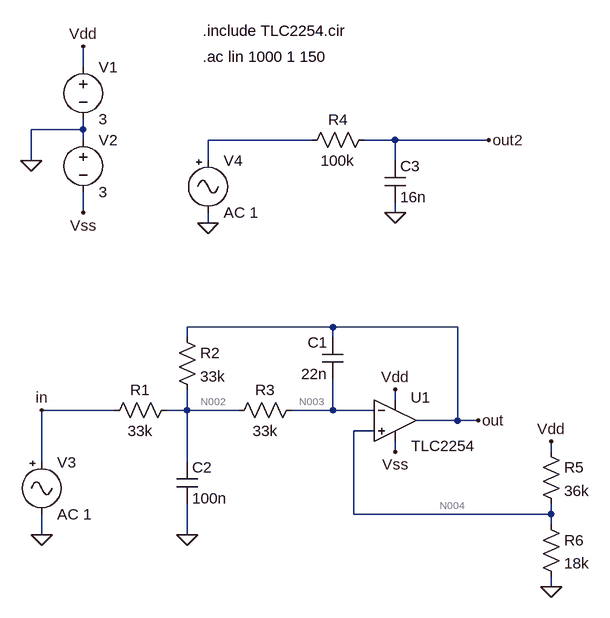
[diagram p0: schematic passa_baixas_mfb_2_ordem.asc]
passa_baixas_mfb_2_ordem.asc, the LTspice schematic file:
Version 4
SHEET 1 1384 680
WIRE -304 -368 -304 -400
WIRE -304 -272 -304 -288
WIRE -304 -272 -384 -272
WIRE -304 -256 -304 -272
WIRE 48 -256 -112 -256
WIRE 176 -256 128 -256
WIRE 320 -256 176 -256
WIRE -384 -224 -384 -272
WIRE -112 -224 -112 -256
WIRE 176 -224 176 -256
WIRE -304 -144 -304 -176
WIRE 176 -144 176 -160
WIRE -112 -128 -112 -144
WIRE 80 32 -144 32
WIRE 272 32 80 32
WIRE -144 48 -144 32
WIRE 80 48 80 32
WIRE 176 144 176 128
WIRE -256 160 -368 160
WIRE -144 160 -144 128
WIRE -144 160 -176 160
WIRE -64 160 -144 160
WIRE 80 160 80 112
WIRE 80 160 16 160
WIRE 144 160 80 160
WIRE 272 176 272 32
WIRE 272 176 208 176
WIRE 304 176 272 176
WIRE 144 192 112 192
WIRE 176 224 176 208
WIRE 416 224 416 208
WIRE -368 240 -368 160
WIRE -144 240 -144 160
WIRE 112 320 112 192
WIRE 416 320 416 304
WIRE 416 320 112 320
WIRE 416 336 416 320
WIRE -368 352 -368 320
WIRE -144 352 -144 304
WIRE 416 432 416 416
FLAG -144 352 0
FLAG -384 -224 0
FLAG -304 -400 Vdd
FLAG 176 128 Vdd
FLAG 176 224 Vss
FLAG -304 -144 Vss
FLAG -368 352 0
FLAG 304 176 out
FLAG -368 160 in
FLAG 176 -144 0
FLAG 320 -256 out2
FLAG -112 -128 0
FLAG 416 432 0
FLAG 416 208 Vdd
SYMBOL Opamps\\TLC2254 176 112 R0
WINDOW 0 24 28 Left 2
WINDOW 3 25 103 Left 2
SYMATTR InstName U1
SYMATTR SpiceModel TLC2254
SYMBOL voltage -304 -384 R0
SYMATTR InstName V1
SYMATTR Value 3
SYMBOL voltage -304 -272 R0
SYMATTR InstName V2
SYMATTR Value 3
SYMBOL Misc\\signal -368 224 R0
WINDOW 123 0 0 Left 2
WINDOW 39 0 0 Left 2
SYMATTR InstName V3
SYMATTR Value AC 1
SYMBOL res -160 32 R0
SYMATTR InstName R2
SYMATTR Value 33k
SYMBOL res -160 144 R90
WINDOW 0 0 56 VBottom 2
WINDOW 3 32 56 VTop 2
SYMATTR InstName R1
SYMATTR Value 33k
SYMBOL cap 96 112 R180
WINDOW 0 24 56 Left 2
WINDOW 3 24 8 Left 2
SYMATTR InstName C1
SYMATTR Value 22n
SYMBOL cap -160 240 R0
SYMATTR InstName C2
SYMATTR Value 100n
SYMBOL res 144 -272 R90
WINDOW 0 0 56 VBottom 2
WINDOW 3 32 56 VTop 2
SYMATTR InstName R4
SYMATTR Value 100k
SYMBOL cap 160 -224 R0
SYMATTR InstName C3
SYMATTR Value 16n
SYMBOL Misc\\signal -112 -240 R0
SYMATTR InstName V4
SYMATTR Value AC 1
SYMBOL res 32 144 R90
WINDOW 0 0 56 VBottom 2
WINDOW 3 32 56 VTop 2
SYMATTR InstName R3
SYMATTR Value 33k
SYMBOL res 400 208 R0
SYMATTR InstName R5
SYMATTR Value 36k
SYMBOL res 400 320 R0
SYMATTR InstName R6
SYMATTR Value 18k
TEXT -120 -384 Left 2 !.ac lin 1000 1 150
TEXT -120 -424 Left 2 !.include TLC2254.cir

The netlist it stands for:
* passa_baixas_mfb_2_ordem.asc
XU1 N004 N003 Vdd Vss out TLC2254 TLC2254  ; pins In+ In- V+ V- OUT
V1 Vdd 0 3
V2 0 Vss 3
V3 in 0 AC 1
R2 out N002 33k
R1 N002 in 33k
C1 N003 out 22n
C2 N002 0 100n
R4 out2 N001 100k
C3 out2 0 16n
V4 N001 0 AC 1
R3 N003 N002 33k
R5 Vdd N004 36k
R6 N004 0 18k
.ac lin 1000 1 150
.include TLC2254.cir
.backanno
.end

* Results of the author's LTspice run, read from the files saved beside the schematic
* Operating Point, zero values left out:
*   V(out) = 2 V
*   V(vss) = -3 V
*   V(vdd) = 3 V
*   V(n003) = 999.9 mV
*   V(n004) = 1 V
*   V(n002) = 999.9 mV
*   I(R6) = 55.56 µA
*   I(R5) = 55.56 µA
*   I(R3) = -1.133 pA
*   I(R1) = 30.3 µA
*   I(R2) = 30.3 µA
*   I(V3) = 30.3 µA
*   I(V2) = -87.08 µA
*   I(V1) = -142.7 µA
*   Ix(u1:1) = 1.152 pA
*   Ix(u1:2) = 1.133 pA
*   Ix(u1:3) = 87.1 µA
*   Ix(u1:4) = -87.08 µA
*   Ix(u1:5) = -30.3 µA
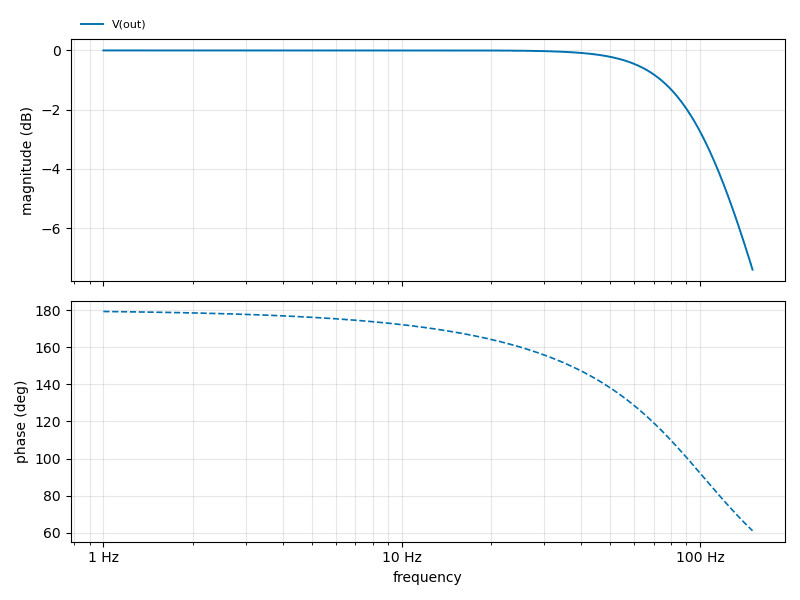
[diagram p1: AC Analysis of passa_baixas_mfb_2_ordem.asc, plotted from the saved traces]
* AC Analysis, 1 run:
*   V(out): -0.00 dB at 1 Hz, -7.40 dB at 150 Hz, peak 0.00 dB at 10.4 Hz, 3 dB below the peak at 103.3 Hz